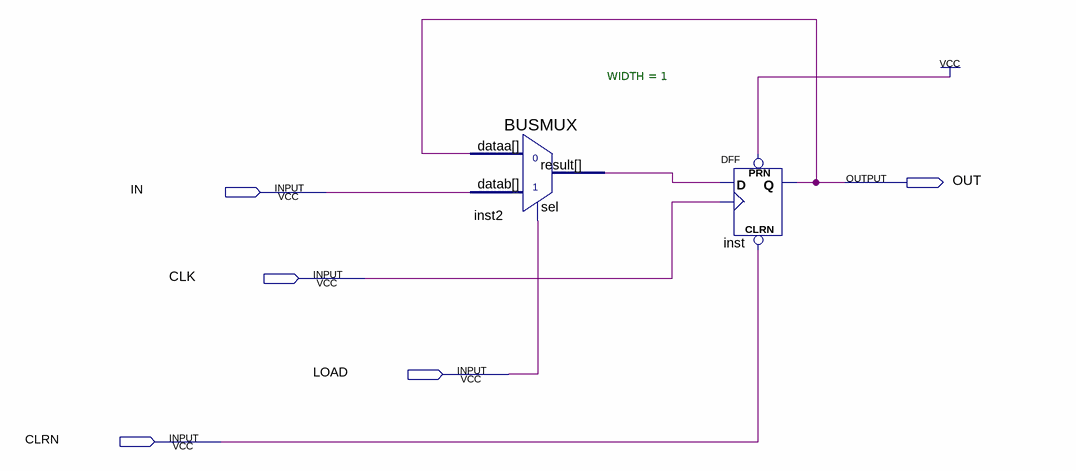
[diagram p0: schematic sheet]
// Quartus schematic register.bdf as structural Verilog: 2 symbols, 5 pins
module register (
  input  IN,
  input  CLK,
  input  LOAD,
  input  CLRN,
  output OUT
);

  wire inst2_result;

  BUSMUX #(.WIDTH(1)) inst2 (.datab(IN), .sel(LOAD), .dataa(OUT), .result(inst2_result));
  DFF inst (.CLRN(CLRN), .CLK(CLK), .D(inst2_result), .PRN(1'b1), .Q(OUT));
endmodule
